# Altium schematic sheet sideMICRO.SchDoc
size A; SheetNumber: 5; SheetTotal: 7
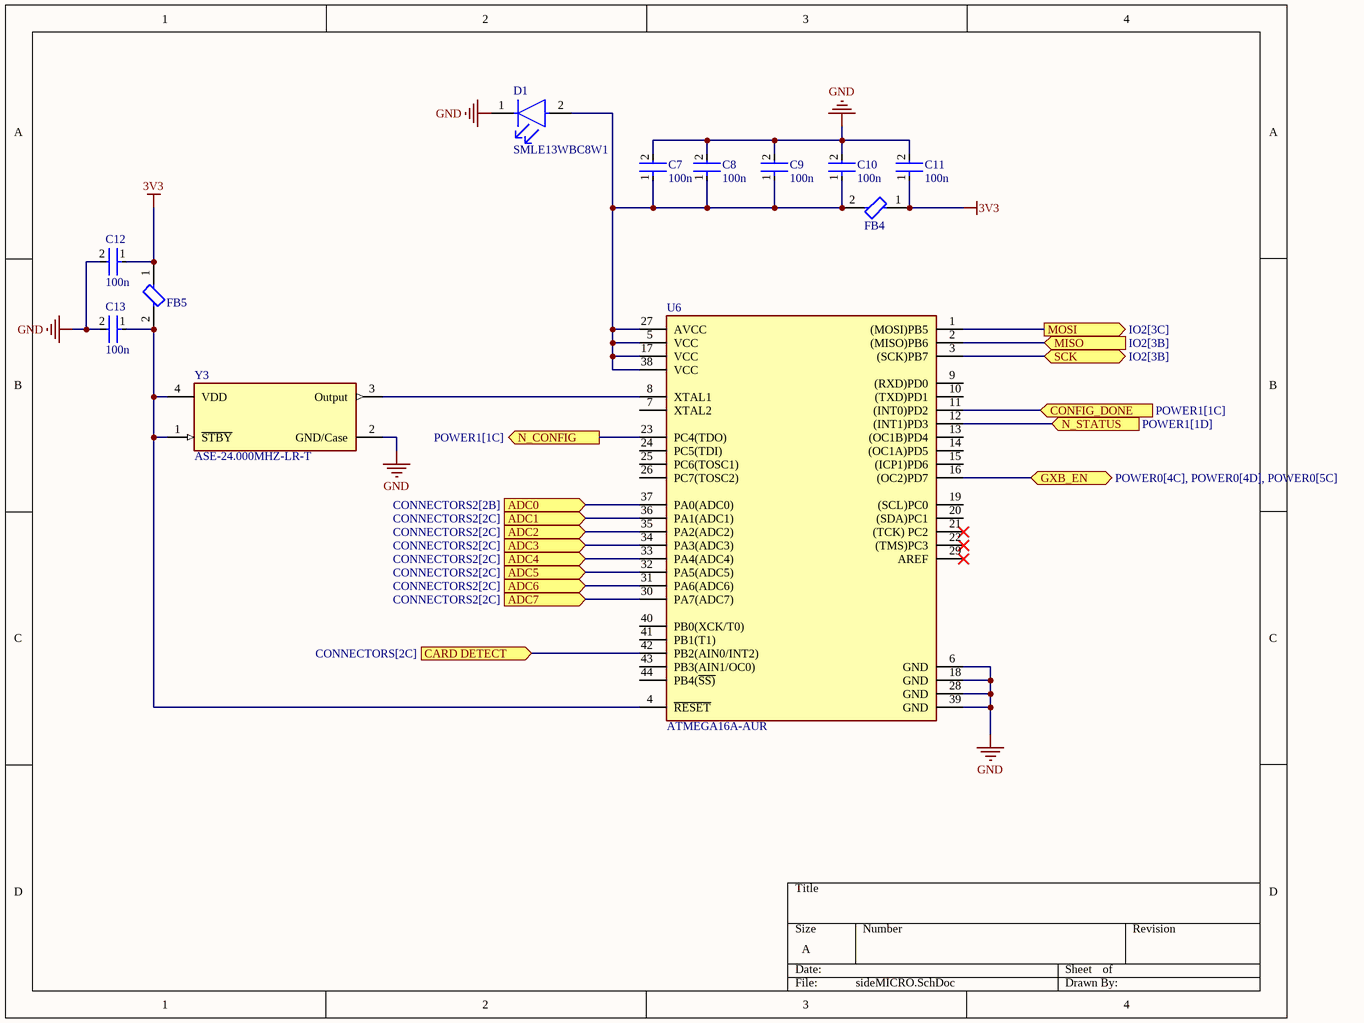
[diagram p0: sideMICRO.SchDoc]

## Parts
C7  100n  [FP-CL10-IPC_C]
C8  100n  [FP-CL10-IPC_C]
C9  100n  [FP-CL10-IPC_C]
C10  100n  [FP-CL10-IPC_C]
C11  100n  [FP-CL10-IPC_C]
C12  100n  [FP-CL10-IPC_C]
C13  100n  [FP-CL10-IPC_C]
D1  SMLE13WBC8W1  [FP-SMLE13WBC8W1-MFG]
FB4  BLM18KG121TN1D  [FP-BLM18-0_15-t0_6-d1_2-IPC_A]  (value not drawn)
FB5  BLM18KG121TN1D  [FP-BLM18-0_15-t0_6-d1_2-IPC_A]  (value not drawn)
U6  ATMEGA16A-AUR  [FP-44A-MFG]
Y3  ASE-24.000MHZ-LR-T  [FP-ASE-MFG]

## Ports
ADC0 (in, see CONNECTORS2[2B]), ADC1 (in, see CONNECTORS2[2C]), ADC2 (in, see CONNECTORS2[2C]), ADC3 (in, see CONNECTORS2[2C]), ADC4 (in, see CONNECTORS2[2C]), ADC5 (in, see CONNECTORS2[2C]), ADC6 (in, see CONNECTORS2[2C]), ADC7 (in, see CONNECTORS2[2C]), CARD DETECT (in, see CONNECTORS[2C]), CONFIG_DONE (in, see POWER1[1C]), GXB_EN (bidir, see POWER0[4C], POWER0[4D], POWER0[5C]), MISO (in, see IO2[3B]), MOSI (out, see IO2[3C]), N_CONFIG (out, see POWER1[1C]), N_STATUS (in, see POWER1[1D]), SCK (bidir, see IO2[3B])

## Nets
3V3: C11.1 C12.1 FB4.1 FB5.1
GND: C7.2 C8.2 C9.2 C10.2 C11.2 C12.2 C13.2 D1.1(C) U6.6(GND) U6.18(GND) U6.28(GND) U6.39(GND) Y3.2(GND/Case)
ADC0: U6.37(PA0(ADC0)) ; port ADC0
ADC1: U6.36(PA1(ADC1)) ; port ADC1
ADC2: U6.35(PA2(ADC2)) ; port ADC2
ADC3: U6.34(PA3(ADC3)) ; port ADC3
ADC4: U6.33(PA4(ADC4)) ; port ADC4
ADC5: U6.32(PA5(ADC5)) ; port ADC5
ADC6: U6.31(PA6(ADC6)) ; port ADC6
ADC7: U6.30(PA7(ADC7)) ; port ADC7
CARD DETECT: U6.42(PB2(AIN0/INT2)) ; port CARD DETECT
CONFIG_DONE: U6.11((INT0)PD2) ; port CONFIG_DONE
GXB_EN: U6.16((OC2)PD7) ; port GXB_EN
MISO: U6.2((MISO)PB6) ; port MISO
MOSI: U6.1((MOSI)PB5) ; port MOSI
N_CONFIG: U6.23(PC4(TDO)) ; port N_CONFIG
N_STATUS: U6.12((INT1)PD3) ; port N_STATUS
SCK: U6.3((SCK)PB7) ; port SCK
NetC7_1: C7.1 C8.1 C9.1 C10.1 D1.2(A) FB4.2 U6.5(VCC) U6.17(VCC) U6.27(AVCC) U6.38(VCC)
NetC13_1: C13.1 FB5.2 U6.4(~{RESET}) Y3.1(~{STBY}) Y3.4(VDD)
NetU6_8: U6.8(XTAL1) Y3.3(Output)

Not connected (* = marked no-connect by the designer): U6 7(XTAL2) 9((RXD)PD0) 10((TXD)PD1) 13((OC1B)PD4) 14((OC1A)PD5) 15((ICP1)PD6) 19((SCL)PC0) 20((SDA)PC1) 21((TCK)_PC2)* 22((TMS)PC3)* 24(PC5(TDI)) 25(PC6(TOSC1)) 26(PC7(TOSC2)) 29(AREF)* 40(PB0(XCK/T0)) 41(PB1(T1)) 43(PB3(AIN1/OC0)) 44(PB4(~{SS)})

## Library data of the parts
C7-C13 = CMP-13271-003017-1: Cap Ceramic 4.7uF 10V X5R ±10% Pad SMD 0603 +85°C T/R; Capacitance: 4.7uF; Case/Package: 0603; Packaging: Tape and Reel; Width: 0.031inch; Contact Plating: Tin; Thickness: 0.035inch; Package Quantity: 1; Voltage Rating: 10V; Case Code (Metric): 1608; Case Code (Imperial): 0603; Depth: 0.8mm; Height: 0.8mm; Tolerance: 10%; Max Operating Temperature: 85°C; Length: 1.6mm; Dielectric: X5R; Mount: Surface Mount; Radiation Hardening: No; Min Operating Temperature: -55°C
D1 = CMP-08952-000004-1: LED WHITE 0603 SMD; Manufacturer: Rohm; Luminous Intensity: 140mcd; Led Orientation: Top View; Reverse Voltage: 5V; Forward Voltage: 2.9V; Forward Current: 5mA; Power Dissipation: 66mW; Temperature Range Low: -40°C; Digikey Description: LED WHITE 0603 SMD; Temperature Range High: +85°C; Temperature: -40°C to +85°C; Manufacturer Part Number: SMLE13WBC8W1; Colour: White; Mouser Description: Standard LEDs - SMD ExceLED White LED 120mcd 5mA; Octopart: https://octopart.com/smle13wbc8w1-rohm-22224565; Automotive: No; Device Class L2: LEDs; Lead Free: Yes; ComponentLink2URL: https://media.digikey.com/pdf/Data%20Sheets/Rohm%20PDFs/SMLE13WBC8W1_Spec.pdf; Device Class L3: unset; Package: 0; RoHS: TRUE; Height: 0.4mm; Category: Diode; Device Class L1: Optoelectronics; ComponentLink2Description: Datasheet
FB4 FB5 = CMP-0686-00554-8: FERRITE BEAD 120 OHM 0603 1LN; Max Current Rating: 3A; DC Resistance (DCR): 30mR; Impedance: 120R; Number of Lines: 1; Test Frequency: 100MHz; Tolerance: 25%; Package Quantity: 4000; Min Operating Temperature: -55°C; Termination: SMD/SMT; REACH SVHC: No SVHC; Core Material: Ferrite; Material: Ferrite; Current Rating: 3A; Height: 0.8mm; Number of Pins: 2; Case/Package: 0603; Case Code (Imperial): 0603; Series: BLM18K; Packaging: Tape and Reel; Inductor Type: FERRITE BEAD; Lead Free: Lead Free; Width: 0.8mm; Case Code (Metric): 1608; Number of Circuits: 1; Max DC Current: 3A; Depth: 0.95mm; Max Operating Temperature: 125°C; Length: 1.6mm; RoHS Compliant: Yes
U6 = CMP-06276-000100-1: IC MCU 8BIT 16KB FLASH 44TQFP; Core Architecture: PIC; Number of I/Os: 13; Peripherals: Brown-out Detect/Reset; Oscillator Type: External; Frequency: 4MHz; Memory Size: 896B; Memory Type: OTP; Case/Package: DIP; Packaging: Rail/Tube; Max Operating Temperature: 70°C; RoHS Compliant: Yes; Min Operating Temperature: 0°C; Series: PIC® 16C
Y3 = CMP-27762-001392-1: XTAL Oscillator 24MHz ±25ppm CMOS 3.3V 4-SMD 3.2mm x 2.5mm; Max Supply Current: 13mA; Load Capacitance: 15pF; Packaging: Tape and Reel; Case/Package: SMD/SMT; Number of Pins: 4; Max Operating Temperature: 85°C; Min Operating Temperature: -40°C; Package Quantity: 1000; Operating Supply Voltage: 3.3V; Lead Free: Lead Free; Height: 0.047inch; Frequency Stability: 25ppm; Series: ASE; Frequency: 24MHz; Length: 0.126inch; Width: 0.098inch; Mount: Surface Mount